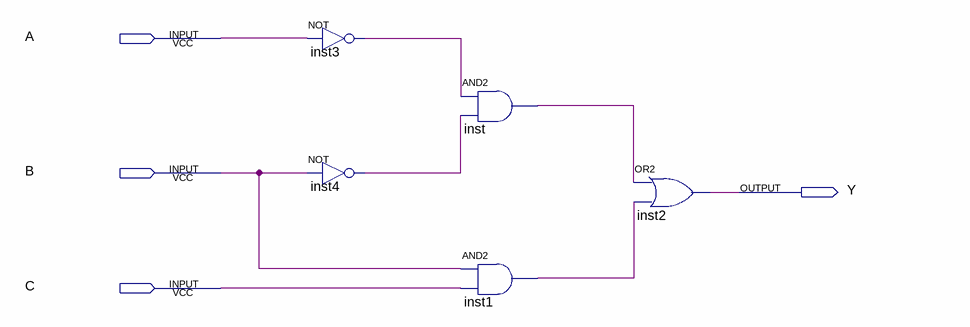
[diagram p0: schematic sheet]
// Quartus schematic circuito2.bdf as structural Verilog: 5 symbols, 4 pins
module circuito2 (
  input  A,
  input  B,
  input  C,
  output Y
);

  wire inst1_out, inst3_out, inst4_out, inst_out;

  not inst3 (inst3_out, A);
  not inst4 (inst4_out, B);
  and inst (inst_out, inst3_out, inst4_out);
  and inst1 (inst1_out, B, C);
  or inst2 (Y, inst_out, inst1_out);
endmodule
